# Altium schematic sheet Hex-Inverter1.SchDoc
size A; SheetNumber: 2; SheetTotal: 3
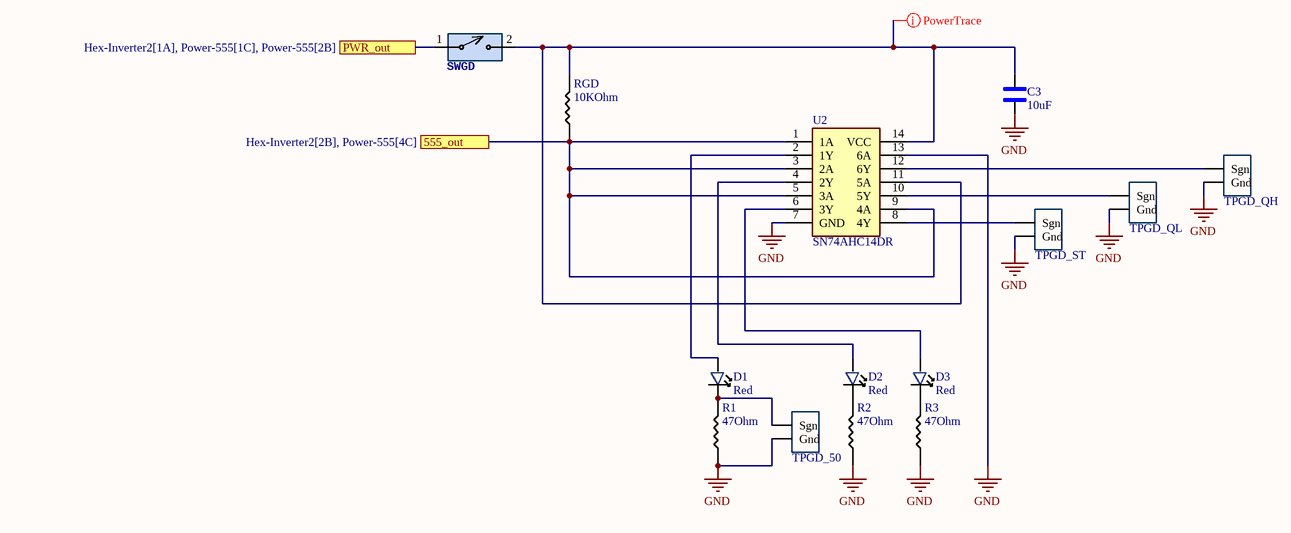
[diagram p0: Hex-Inverter1.SchDoc]

## Parts
C3  10uF  [1206_Passive_Capacitor]
D1  Red  [LED_1206]
D2  Red  [LED_1206]
D3  Red  [LED_1206]
R1  value 47Ohm  [1206_Passive_Resitor]  (hidden comment: 47 Ohms)
R2  value 47Ohm  [1206_Passive_Resitor]  (hidden comment: 47 Ohms)
R3  value 47Ohm  [1206_Passive_Resitor]  (hidden comment: 47 Ohms)
RGD  value 10KOhm  [1206_Passive_Resitor]  (hidden comment: 10k)
SWGD  SW_2Pin_100mil_Switch  [2Pin-Header-Conn]  (value not drawn)
TPGD_50  10x Probe TP  [TP10x_Probe]  (value not drawn)
TPGD_QH  10x Probe TP  [TP10x_Probe]  (value not drawn)
TPGD_QL  10x Probe TP  [TP10x_Probe]  (value not drawn)
TPGD_ST  10x Probe TP  [TP10x_Probe]  (value not drawn)
U2  SN74AHC14DR  [HEX_74AC14]

## Ports
555_out (see Hex-Inverter2[2B], Power-555[4C]), PWR_out (see Hex-Inverter2[1A], Power-555[1C], Power-555[2B])

## Nets
GND: C3.1 R1.1 R2.1 R3.1 TPGD_50.2(Gnd) TPGD_QH.2(Gnd) TPGD_QL.2(Gnd) TPGD_ST.2(Gnd) U2.7(GND) U2.13(6A)
555_out: RGD.1 U2.1(1A) U2.3(2A) U2.5(3A) U2.9(4A) ; port 555_out
PWR_out: SWGD.1 ; port PWR_out
NetC3_2: C3.2 RGD.2 SWGD.2 U2.11(5A) U2.14(VCC)
NetD1_1: D1.1 U2.2(1Y)
NetD1_2: D1.2 R1.2 TPGD_50.1(Sgn)
NetD2_1: D2.1 U2.4(2Y)
NetD2_2: D2.2 R2.2
NetD3_1: D3.1 U2.6(3Y)
NetD3_2: D3.2 R3.2
NetTPGD_QH_1: TPGD_QH.1(Sgn) U2.12(6Y)
NetTPGD_QL_1: TPGD_QL.1(Sgn) U2.10(5Y)
NetTPGD_ST_1: TPGD_ST.1(Sgn) U2.8(4Y)

## Layout directives
rule Width Constraint [Pref Width = 20mil    Min Width = 10mil    Max Width = 50mil]: NetC3_2

## Library data of the parts
C3 = C_10uF_1206: 10uF ±10% 50V X5R 1206 Multilayer Ceramic Capacitors MLCC - SMD/SMT RoHS; MFR Part #: CL31A106KBHNNNE; Type: Basic; LCSC Part#: C13585; Datasheet: https://datasheet.lcsc.com/lcsc/1810221112_Samsung-Electro-Mechanics-CL31A106KBHNNNE_C13585.pdf; Value: 10uF
D1-D3 = LED_RED_1206: Red 621~631nm 1206 Light Emitting Diodes (LED) RoHS; MFR Part #: 15-21/R6C-FQ1R1B/2T; Type: Extended; LCSC Part#: C93133; Datasheet: https://datasheet.lcsc.com/szlcsc/1811151241_Everlight-Elec-15-21-R6C-FQ1R1B-2T_C93133.pdf; Value: Red
R1-R3 = R_47Ohm_1206: 47Ω ±5% 0.25W ±200ppm/℃ 1206 Chip Resistor - Surface Mount RoHS; MFR Part #: 1206W4J0470T5E; LCSC Part#: C25384; Type: Extended; Datasheet: https://datasheet.lcsc.com/lcsc/1811101020_UNI-ROYAL-Uniroyal-Elec-1206W4J0470T5E_C25384.pdf
RGD = R_10KOhm_1206: 10 kOhms ±5% 0.25W, 1/4W Chip Resistor 1206 (3216 Metric) Automotive AEC-Q200 Thick Film; MFR Part #: RMCF1206FT10K0; Digikey Link: https://www.digikey.com/en/products/detail/stackpole-electronics-inc/RMCF1206FT10K0/1759669; LCSC Part#: C17902; Type: Basic
SWGD = SW_2Pin_100mil_Switch: 2Pin Header; LCSC Part#: C124375; Type: Extended
TPGD_50 TPGD_QH TPGD_QL TPGD_ST = TP_10x_Probe: Test Point 300 mil centers
U2 = U_74AHC14: Inverter IC 6 Channel Schmitt Trigger 14-SOIC; Datasheet: https://datasheet.lcsc.com/szlcsc/ON-Semicon-ON-74AC14SCX_C5482.pdf; MFR Part #: SN74AHC14DR; LCSC Part#: C6942; Type: Extended